# EAGLE schematic StartHere (EAGLE 7.6.0)
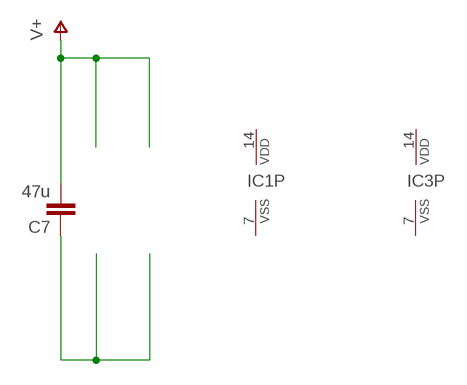
[diagram p0: schematic, sheet 1]

## Parts
C7  47u  C7.5/3  [C7.5B3]
IC1  4013N  [DIL14]
IC3  4013N  [DIL14]

## Nets
N$4: C7.1
V+: C7.2
Unconnected: IC1.1(A:Q) IC1.2(A:!Q) IC1.3(A:CLK) IC1.4(A:R) IC1.5(A:D) IC1.6(A:S) IC1.8(B:S) IC1.9(B:D) IC1.10(B:R) IC1.11(B:CLK) IC1.12(B:!Q) IC1.13(B:Q) IC3.1(A:Q) IC3.2(A:!Q) IC3.3(A:CLK) IC3.4(A:R) IC3.5(A:D) IC3.6(A:S) IC3.8(B:S) IC3.9(B:D) IC3.10(B:R) IC3.11(B:CLK) IC3.12(B:!Q) IC3.13(B:Q)

## Power pins joined to a net without a drawn wire
VDD: IC1.14(P:VDD) IC3.14(P:VDD)
VSS: IC1.7(P:VSS) IC3.7(P:VSS)

## Library data of the parts
C7 = capacitor-wima:C: CAPACITOR naming: grid - package width
IC1 IC3 = 40xx:4013: Dual D FLIP FLOP, set/reset